# EAGLE design pshield (EAGLE 5.11)
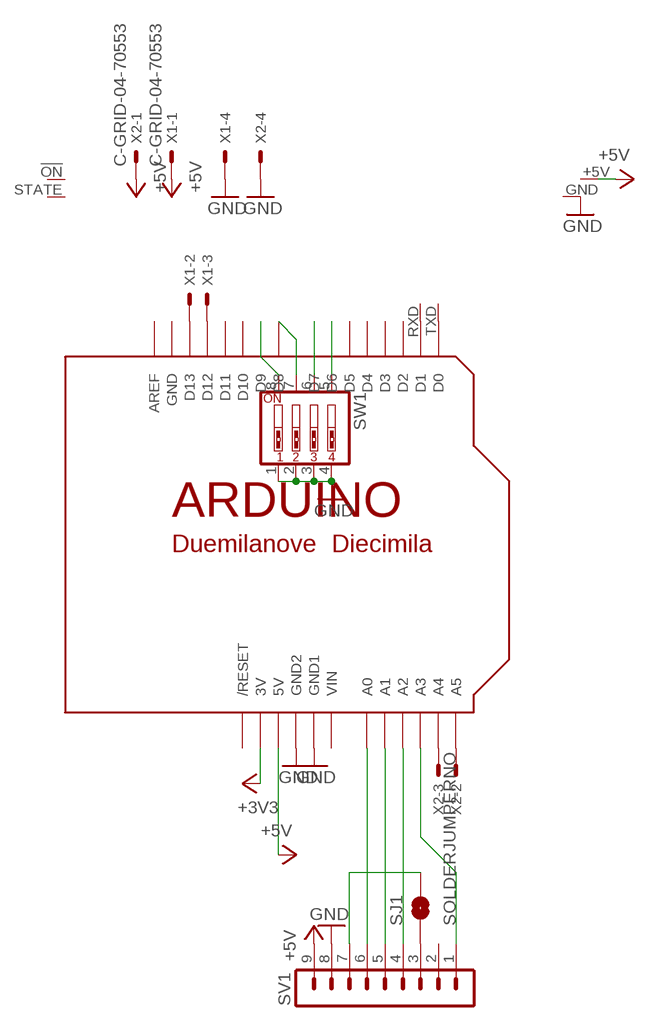
[diagram p0: schematic, sheet 1]

## Parts
SJ1  SOLDERJUMPERNO  [SJ_2S-NO]
SV1  MA09-1  [MA09-1]
SW1  SW_DIP-4  [EDG-04]
U$1  ARDUINO-NOHOLE  [ARDUINO-NOHOLE]
U$2  GLB-BLUETOOTH  [BT]
X1  C-GRID-04-70553  [70553-04]
X2  C-GRID-04-70553  [70553-04]

## Nets
+3V3: U$1.3V
+5V: SV1.9 U$1.5V U$2.+5V X1.1 X2.1
GND: SV1.8 SW1.1 SW1.2 SW1.3 SW1.4 U$1.GND1 U$1.GND2 U$2.GND X1.4 X2.4
N$1: U$1.D1 U$2.RXD
N$2: U$1.D0 U$2.TXD
N$3: U$1.D13 X1.2
N$4: U$1.D12 X1.3
N$5: U$1.A4 X2.3
N$6: U$1.A5 X2.2
N$7: SW1.5 U$1.D6
N$8: SW1.6 U$1.D7
N$9: SW1.7 U$1.D8
N$10: SW1.8 U$1.D9
N$11: SV1.6 U$1.A0
N$12: SV1.5 U$1.A1
N$13: SV1.4 U$1.A2
N$14: SJ1.1 SV1.3
N$15: SJ1.2 SV1.7
N$16: SV1.1 U$1.A3
Unconnected: SV1.2 U$1.AREF U$1.D2 U$1.D3 U$1.D4 U$1.D5 U$1.D10 U$1.D11 U$1.RESET(/RESET) U$2.!ON U$2.STATE

## Power pins joined to a net without a drawn wire
GND: U$1.GND
VIN: U$1.VIN

## Library data of the parts
SJ1 = SparkFun:SOLDERJUMPER: Solder Jumper Standard SMD solder jumper. Used to automate production. Two varients : Normally Open and Normally Closed are the same, but have different paste layers. NC will have a large amount of paste and should jumper during reflow.
SV1 = con-lstb:MA09-1: PIN HEADER; OC_FARNELL: unknown; OC_NEWARK: unknown
SW1 = special:SW_DIP-4: DIP SWITCH
U$1 = adafruit:ARDUINO: Arduino Diecimila/Duemilanove Make a shield with ease, this package has all the named pins as well as the two mounting drill holes and an outline of the USB and DC power connector. The outline is on the DIMENSION layer, so if your board house uses it they will cut the outline to match. http://www.ladyada.net/library/pcb/eaglelibrary.html
U$2 = goodluckbuy-bluetooth:GLB-BLUETOOTH
X1 X2 = con-molex:C-GRID-04: CONNECTOR wire to board 2.54 mm (0.100") pitch header; OC_FARNELL: unknown; OC_NEWARK: unknown

## Board
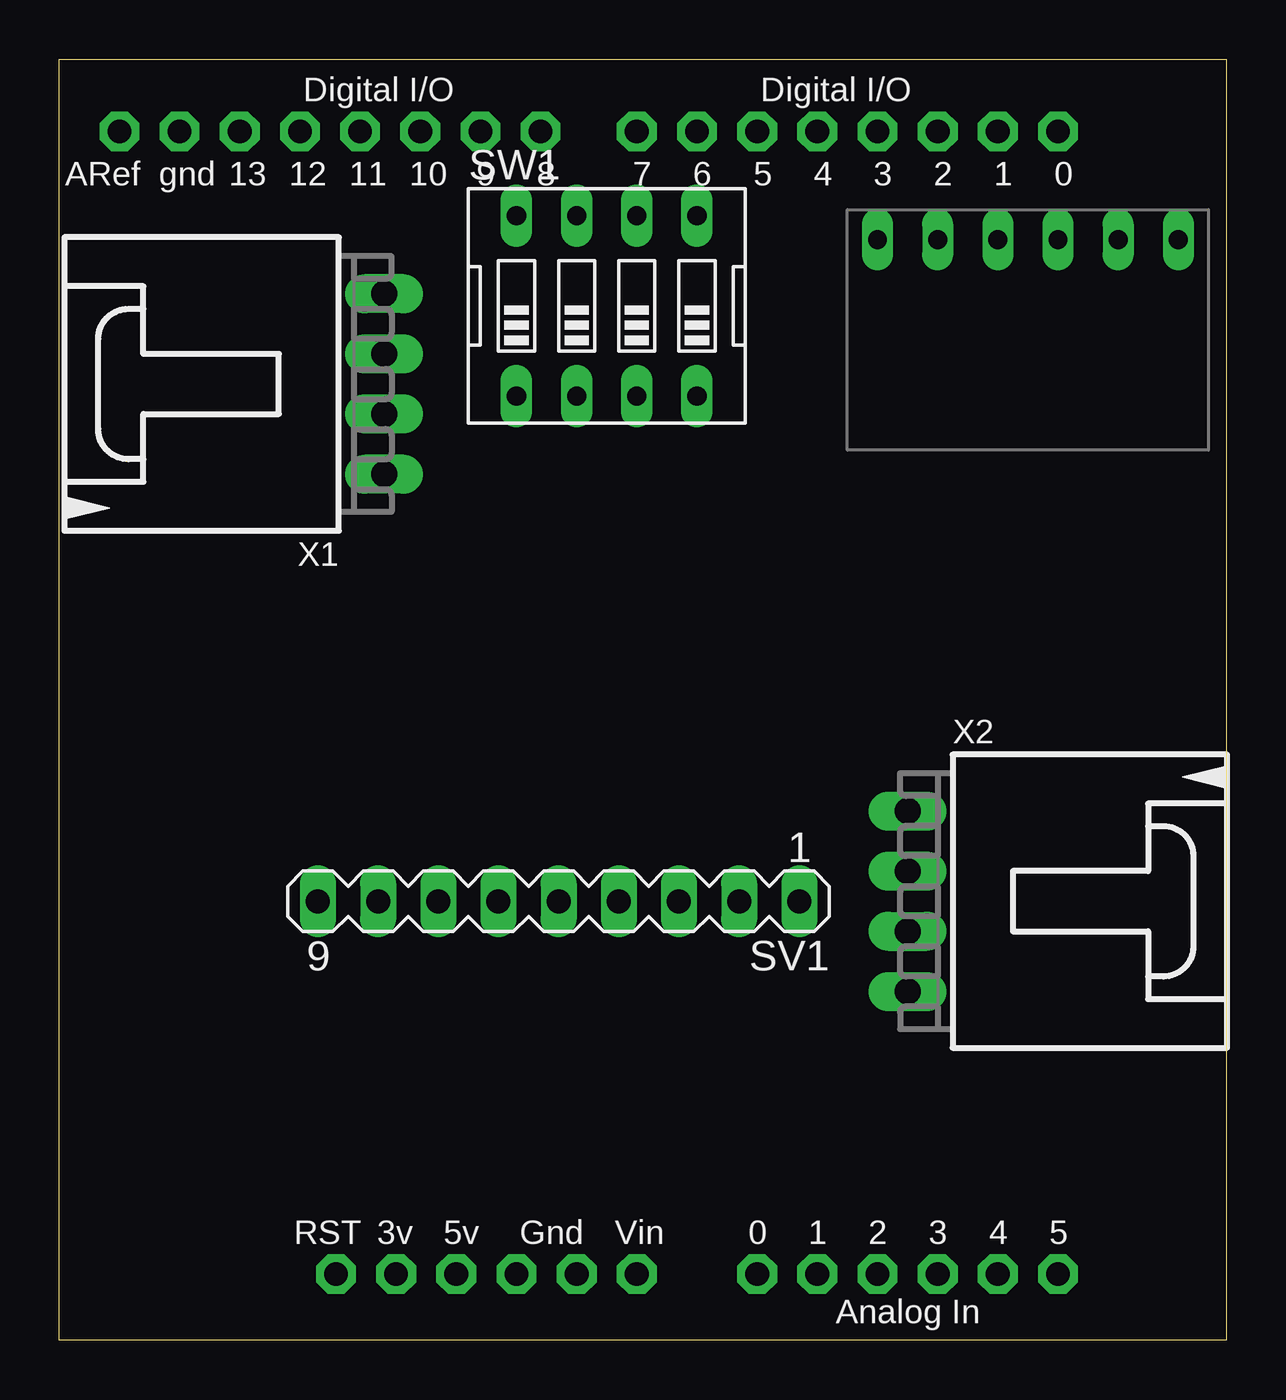
[diagram p1: board, top side]
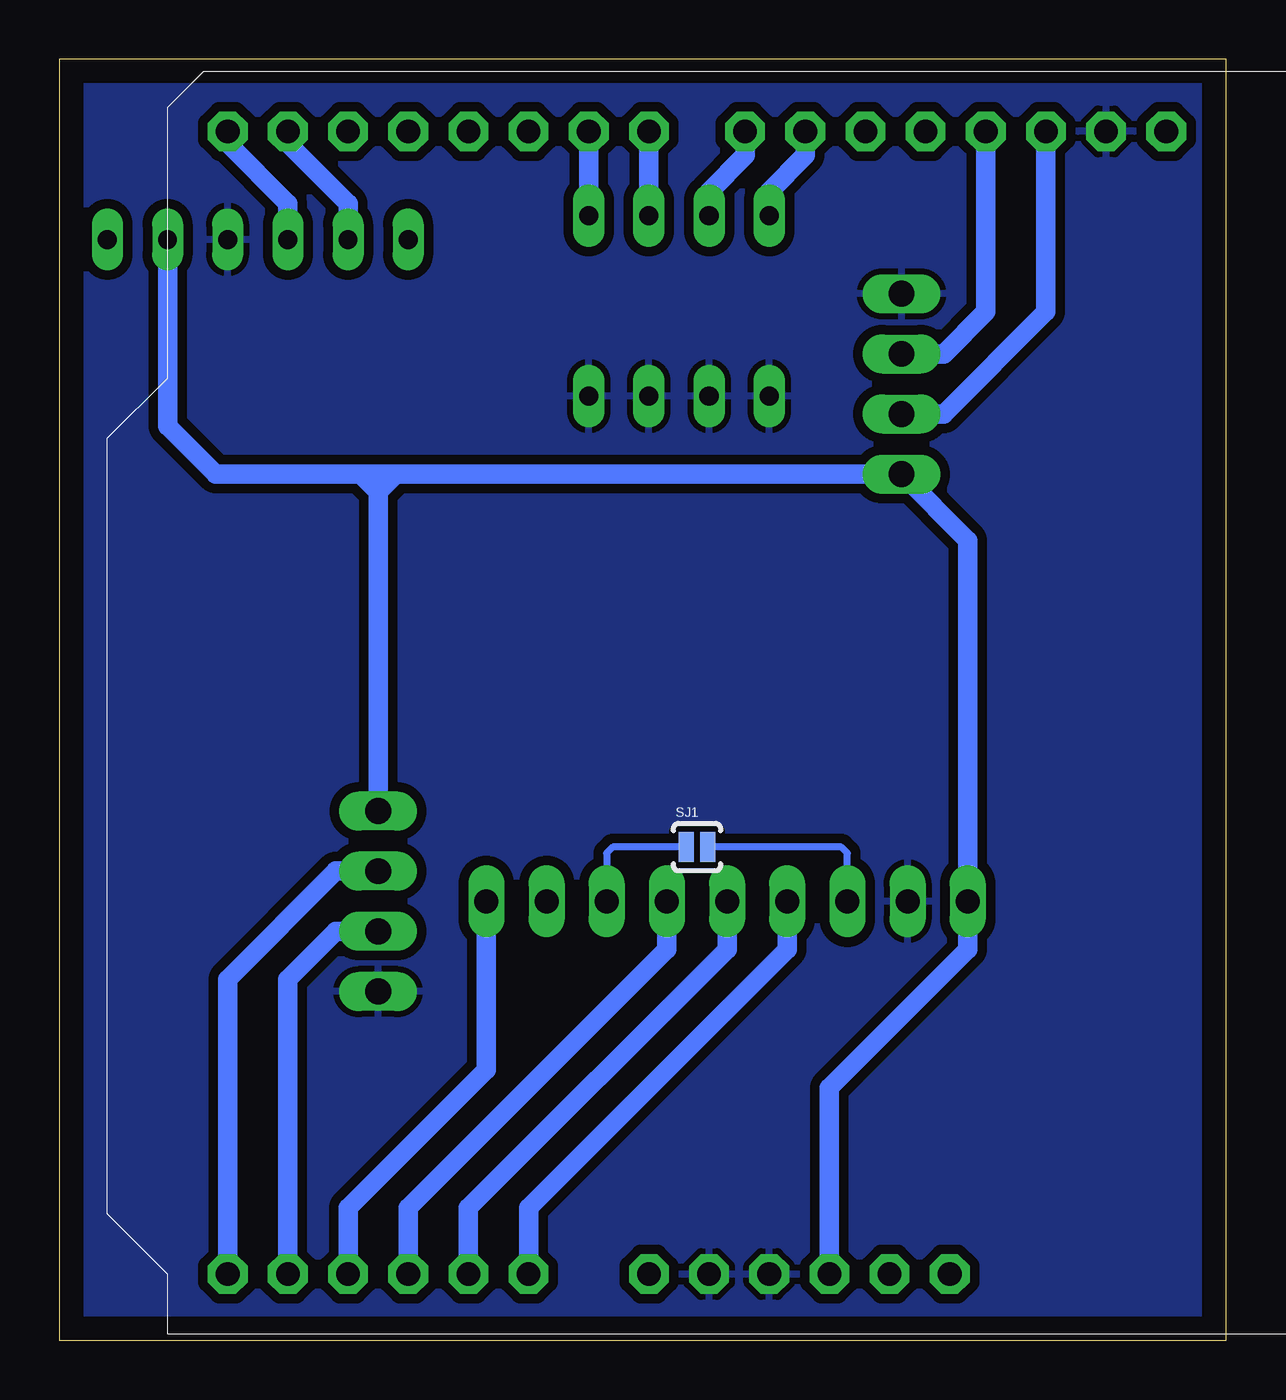
[diagram p2: board, bottom side, seen from below]

Size 49.28 x 54.1 mm. Coordinates in mm from the lower left corner, seen from the top.
Outline: 0,54.1 49.28,54.1 49.28,0 0,0 0,54.1
Copper layers (1*16): Top 0.035mm / dielectric 1.5mm / Bottom 0.035mm
Design rules "default": minimum track width 10mil, minimum drill 0.6mm, track to track 8mil, track to pad 8mil, pad to pad 8mil, via to via 8mil, smd to smd 8mil, copper to edge 40mil, drill to drill 8mil, minimum pad ring 10mil, minimum via ring 8mil, stop-mask expansion 4mil, vias tented up to drill 0mil, thermal gap 10mil

### Footprints (pad centres in the part's own frame; a part is rotated, then mirrored left to right if it is on the bottom)
SJ_2S-NO = smd 0.635 x 1.27: 1 -0.45,0; 2 0.45,0
MA09-1 = drill 1.016 long: 1 -10.16,0; 2 -7.62,0; 3 -5.08,0; 4 -2.54,0; 5 0,0; 6 2.54,0; 7 5.08,0; 8 7.62,0; 9 10.16,0
EDG-04 = drill 0.813 long: 1 -3.81,-3.81; 2 -1.27,-3.81; 3 1.27,-3.81; 4 3.81,-3.81; 5 3.81,3.81; 6 1.27,3.81; 7 -1.27,3.81; 8 -3.81,3.81
ARDUINO-NOHOLE = drill 1 pad 1.676 octagon: 3V 35.56,2.54; 5V 38.1,2.54; A0 50.8,2.54; A1 53.34,2.54; A2 55.88,2.54; A3 58.42,2.54; A4 60.96,2.54; A5 63.5,2.54; AREF 23.876,50.8; D0 63.5,50.8; D1 60.96,50.8; D2 58.42,50.8; D3 55.88,50.8; D4 53.34,50.8; D5 50.8,50.8; D6 48.26,50.8; D7 45.72,50.8; D8 41.656,50.8; D9 39.116,50.8; D10 36.576,50.8; D11 34.036,50.8; D12 31.496,50.8; D13 28.956,50.8; GND 26.416,50.8; GND1 43.18,2.54; GND2 40.64,2.54; RESET 33.02,2.54; VIN 45.72,2.54
BT = drill 0.8 long: !ON 0,6.35; +5V 0,3.81; GND 0,1.27; RXD 0,-3.81; STATE 0,-6.35; TXD 0,-1.27
70553-04 = drill 1.092 long: 1 -3.81,-7.62; 2 -1.27,-7.62; 3 1.27,-7.62; 4 3.81,-7.62

### Placement (x,y rotation side)
SJ1  22.35,20.83 0 bottom
SV1  21.08,18.54 180 top
SW1  23.11,43.69 0 top
U$1  -21.34,0.25 0 top
U$2  40.89,46.48 270 top
X1  6.1,40.39 90 top
X2  43.43,18.54 270 top

### Tracks (layer width: path | path; a pad name or v marks a point on that pad's centre or on a via)
+5V
  Bottom 0.813: U$1.5V 16.76,10.67 10.92,16.51 SV1.9 10.92,33.78 X1.1 35.05,36.58 | U$2.+5V 44.7,38.61 42.67,36.58 36.58,36.58 | 35.81,36.58 36.58,36.58 | 35.81,36.58 35.81,35.81 | 35.81,35.81 X2.1 | 35.05,36.58 35.81,36.58 | 35.05,36.58 35.81,35.81 | 35.81,35.81 36.58,36.58
GND
  pour Bottom (isolate 0.406): -22.61,59.94 54.86,59.94 54.86,-7.37 -22.61,-7.37 -22.61,58.67
N$1
  Bottom 0.813: U$1.D1 39.62,50.55 37.08,48.01 U$2.RXD
N$2
  Bottom 0.813: U$1.D0 42.16,50.55 39.62,48.01 U$2.TXD
N$3
  Bottom 0.813: U$1.D13 7.62,43.43 11.94,39.12 X1.2
N$4
  Bottom 0.813: U$1.D12 10.16,43.43 11.94,41.66 X1.3
N$5
  Bottom 0.813: U$1.A4 39.62,15.24 37.59,17.27 X2.3
N$6
  Bottom 0.813: U$1.A5 42.16,15.24 37.59,19.81 X2.2
N$7
  Bottom 0.813: SW1.5 U$1.D6
N$8
  Bottom 0.813: SW1.6 U$1.D7
N$9
  Bottom 0.813: SW1.7 21.84,48.51 20.32,50.04 U$1.D8
N$10
  Bottom 0.813: SW1.8 19.3,48.51 17.78,50.04 U$1.D9
N$11
  Bottom 0.813: U$1.A0 29.46,5.59 18.54,16.51 SV1.6
N$12
  Bottom 0.813: U$1.A1 32,5.59 21.08,16.51 SV1.5
N$13
  Bottom 0.813: U$1.A2 34.54,5.59 23.62,16.51 SV1.4
N$14
  Bottom 0.305: SV1.3 26.16,20.57 25.91,20.83 SJ1.1
N$15
  Bottom 0.305: SV1.7 16,20.57 16.26,20.83 SJ1.2
N$16
  Bottom 0.813: SV1.1 31.24,11.43 37.08,5.59 U$1.A3